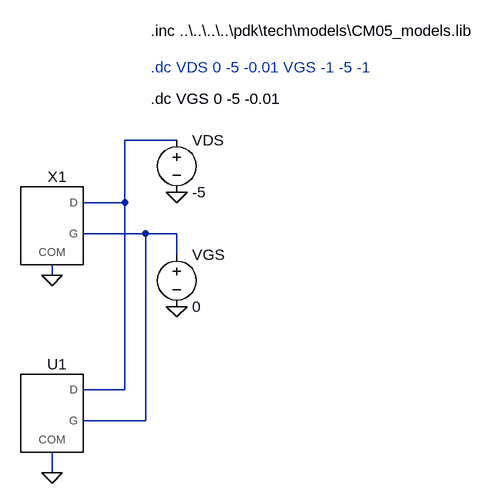
[diagram p0: schematic Unidad_P_tb.asc]
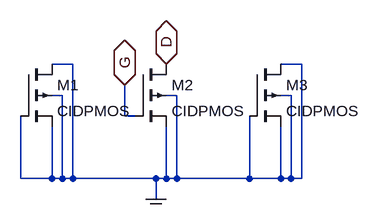
[diagram p1: sub-circuit unidad_p.asc]
Unidad_P_tb.asc, the LTspice schematic file:
Version 4.1
SHEET 1 1252 680
WIRE 368 32 288 32
WIRE 288 128 288 32
WIRE 288 128 224 128
WIRE 320 176 224 176
WIRE 368 176 320 176
WIRE 368 208 368 176
WIRE 176 240 176 224
WIRE 288 416 288 128
WIRE 288 416 224 416
WIRE 320 464 320 176
WIRE 320 464 224 464
WIRE 176 544 176 512
FLAG 176 240 0
FLAG 368 112 0
FLAG 368 288 0
FLAG 176 544 0
SYMBOL Unidad_P 176 160 R0
SYMATTR InstName X1
SYMBOL voltage 368 16 R0
WINDOW 123 0 0 Left 0
WINDOW 39 0 0 Left 0
SYMATTR InstName VDS
SYMATTR Value -5
SYMBOL voltage 368 192 R0
WINDOW 123 0 0 Left 0
WINDOW 39 0 0 Left 0
SYMATTR InstName VGS
SYMATTR Value 0
SYMBOL Unidad_P_Lay 176 448 R0
SYMATTR InstName U1
TEXT 328 -80 Left 2 ;.dc VDS 0 -5 -0.01 VGS -1 -5 -1
TEXT 328 -136 Left 2 !.inc ..\\..\\..\\..\\pdk\\tech\\models\\CM05_models.lib
TEXT 328 -32 Left 2 !.dc VGS 0 -5 -0.01

unidad_p.asc, the sub-circuit schematic file:
Version 4.1
SHEET 1 880 680
WIRE 96 128 64 128
WIRE 448 128 416 128
WIRE 80 176 64 176
WIRE 256 176 240 176
WIRE 432 176 416 176
WIRE 176 208 176 160
WIRE 192 208 176 208
WIRE 16 304 16 208
WIRE 64 304 64 224
WIRE 64 304 16 304
WIRE 80 304 80 176
WIRE 80 304 64 304
WIRE 96 304 96 128
WIRE 96 304 80 304
WIRE 224 304 96 304
WIRE 240 304 240 224
WIRE 240 304 224 304
WIRE 256 304 256 176
WIRE 256 304 240 304
WIRE 368 304 368 208
WIRE 368 304 256 304
WIRE 416 304 416 224
WIRE 416 304 368 304
WIRE 432 304 432 176
WIRE 432 304 416 304
WIRE 448 304 448 128
WIRE 448 304 432 304
WIRE 224 336 224 304
FLAG 240 128 D
IOPIN 240 128 BiDir
FLAG 176 160 G
IOPIN 176 160 BiDir
FLAG 224 336 COM
IOPIN 224 336 BiDir
SYMBOL pmos4 16 128 R0
SYMATTR InstName M1
SYMATTR Value CIDPMOS
SYMATTR Value2 l=10u w=100u
SYMBOL pmos4 192 128 R0
SYMATTR InstName M2
SYMATTR Value CIDPMOS
SYMATTR Value2 l=10u w=100u
SYMBOL pmos4 368 128 R0
SYMATTR InstName M3
SYMATTR Value CIDPMOS
SYMATTR Value2 l=10u w=100u

The netlist it stands for:
* Unidad_P_tb.asc
X§X1 N001 N002 0 unidad_p
VDS N001 0 -5
VGS N002 0 0
X§U1 N001 N002 0 Unidad_P  ; pins D G COM

* block symbol definitions
.subckt unidad_p D G COM
M1 COM COM COM COM CIDPMOS l=10u w=100u
M2 D G COM COM CIDPMOS l=10u w=100u
M3 COM COM COM COM CIDPMOS l=10u w=100u
.ends unidad_p

.model NMOS NMOS
.model PMOS PMOS
.lib standard.mos
* .dc VDS 0 -5 -0.01 VGS -1 -5 -1
.inc ..\..\..\..\pdk\tech\models\CM05_models.lib
.dc VGS 0 -5 -0.01
.backanno
.end